# EAGLE schematic FE LED (EAGLE 9.6.2)
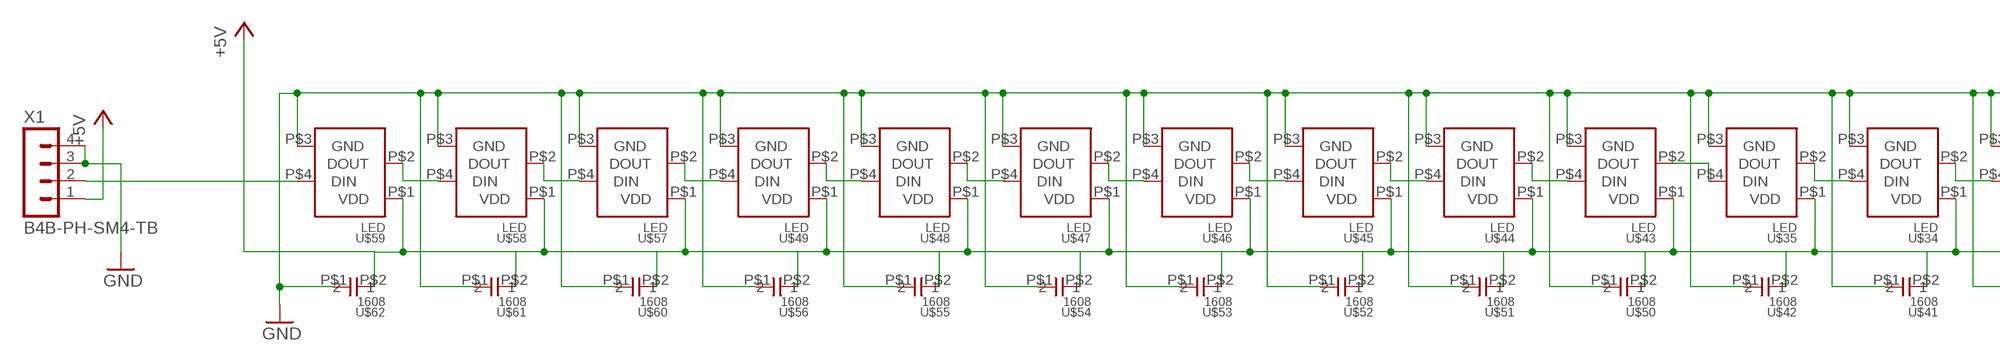
[diagram p0: schematic, sheet 1, part 1 of 2]
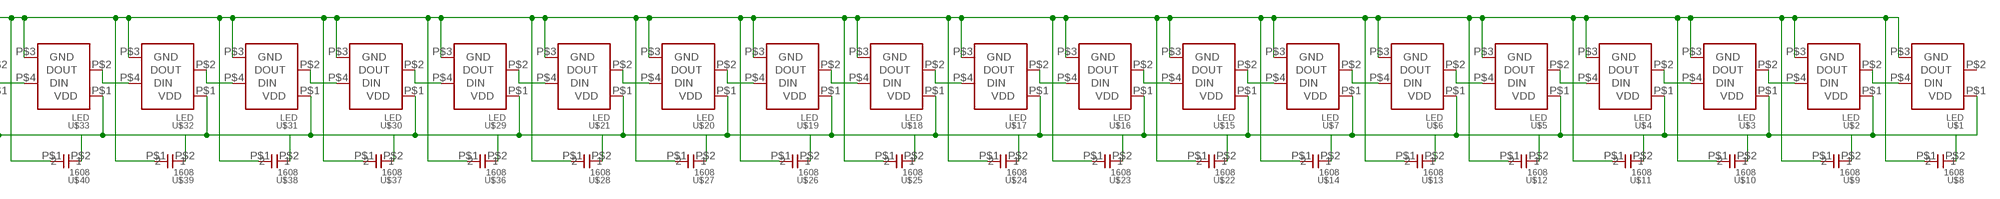
[diagram p1: schematic, sheet 1, part 2 of 2]

## Parts
U$1  LED  [LED]
U$2  LED  [LED]
U$3  LED  [LED]
U$4  LED  [LED]
U$5  LED  [LED]
U$6  LED  [LED]
U$7  LED  [LED]
U$8  1608  [CON]
U$9  1608  [CON]
U$10  1608  [CON]
U$11  1608  [CON]
U$12  1608  [CON]
U$13  1608  [CON]
U$14  1608  [CON]
U$15  LED  [LED]
U$16  LED  [LED]
U$17  LED  [LED]
U$18  LED  [LED]
U$19  LED  [LED]
U$20  LED  [LED]
U$21  LED  [LED]
U$22  1608  [CON]
U$23  1608  [CON]
U$24  1608  [CON]
U$25  1608  [CON]
U$26  1608  [CON]
U$27  1608  [CON]
U$28  1608  [CON]
U$29  LED  [LED]
U$30  LED  [LED]
U$31  LED  [LED]
U$32  LED  [LED]
U$33  LED  [LED]
U$34  LED  [LED]
U$35  LED  [LED]
U$36  1608  [CON]
U$37  1608  [CON]
U$38  1608  [CON]
U$39  1608  [CON]
U$40  1608  [CON]
U$41  1608  [CON]
U$42  1608  [CON]
U$43  LED  [LED]
U$44  LED  [LED]
U$45  LED  [LED]
U$46  LED  [LED]
U$47  LED  [LED]
U$48  LED  [LED]
U$49  LED  [LED]
U$50  1608  [CON]
U$51  1608  [CON]
U$52  1608  [CON]
U$53  1608  [CON]
U$54  1608  [CON]
U$55  1608  [CON]
U$56  1608  [CON]
U$57  LED  [LED]
U$58  LED  [LED]
U$59  LED  [LED]
U$60  1608  [CON]
U$61  1608  [CON]
U$62  1608  [CON]
X1  B4B-PH-SM4-TB  [B4B-PH-SM4-TB]

## Nets
+5V: U$1.P$1(VDD) U$2.P$1(VDD) U$3.P$1(VDD) U$4.P$1(VDD) U$5.P$1(VDD) U$6.P$1(VDD) U$7.P$1(VDD) U$8.P$2 U$9.P$2 U$10.P$2 U$11.P$2 U$12.P$2 U$13.P$2 U$14.P$2 U$15.P$1(VDD) U$16.P$1(VDD) U$17.P$1(VDD) U$18.P$1(VDD) U$19.P$1(VDD) U$20.P$1(VDD) U$21.P$1(VDD) U$22.P$2 U$23.P$2 U$24.P$2 U$25.P$2 U$26.P$2 U$27.P$2 U$28.P$2 U$29.P$1(VDD) U$30.P$1(VDD) U$31.P$1(VDD) U$32.P$1(VDD) U$33.P$1(VDD) U$34.P$1(VDD) U$35.P$1(VDD) U$36.P$2 U$37.P$2 U$38.P$2 U$39.P$2 U$40.P$2 U$41.P$2 U$42.P$2 U$43.P$1(VDD) U$44.P$1(VDD) U$45.P$1(VDD) U$46.P$1(VDD) U$47.P$1(VDD) U$48.P$1(VDD) U$49.P$1(VDD) U$50.P$2 U$51.P$2 U$52.P$2 U$53.P$2 U$54.P$2 U$55.P$2 U$56.P$2 U$57.P$1(VDD) U$58.P$1(VDD) U$59.P$1(VDD) U$60.P$2 U$61.P$2 U$62.P$2 X1.1
GND: U$1.P$3(GND) U$2.P$3(GND) U$3.P$3(GND) U$4.P$3(GND) U$5.P$3(GND) U$6.P$3(GND) U$7.P$3(GND) U$8.P$1 U$9.P$1 U$10.P$1 U$11.P$1 U$12.P$1 U$13.P$1 U$14.P$1 U$15.P$3(GND) U$16.P$3(GND) U$17.P$3(GND) U$18.P$3(GND) U$19.P$3(GND) U$20.P$3(GND) U$21.P$3(GND) U$22.P$1 U$23.P$1 U$24.P$1 U$25.P$1 U$26.P$1 U$27.P$1 U$28.P$1 U$29.P$3(GND) U$30.P$3(GND) U$31.P$3(GND) U$32.P$3(GND) U$33.P$3(GND) U$34.P$3(GND) U$35.P$3(GND) U$36.P$1 U$37.P$1 U$38.P$1 U$39.P$1 U$40.P$1 U$41.P$1 U$42.P$1 U$43.P$3(GND) U$44.P$3(GND) U$45.P$3(GND) U$46.P$3(GND) U$47.P$3(GND) U$48.P$3(GND) U$49.P$3(GND) U$50.P$1 U$51.P$1 U$52.P$1 U$53.P$1 U$54.P$1 U$55.P$1 U$56.P$1 U$57.P$3(GND) U$58.P$3(GND) U$59.P$3(GND) U$60.P$1 U$61.P$1 U$62.P$1 X1.3 X1.4
N$3: U$59.P$4(DIN) X1.2
N$4: U$1.P$4(DIN) U$2.P$2(DOUT)
N$5: U$2.P$4(DIN) U$3.P$2(DOUT)
N$6: U$3.P$4(DIN) U$4.P$2(DOUT)
N$7: U$4.P$4(DIN) U$5.P$2(DOUT)
N$8: U$5.P$4(DIN) U$6.P$2(DOUT)
N$9: U$6.P$4(DIN) U$7.P$2(DOUT)
N$12: U$15.P$4(DIN) U$16.P$2(DOUT)
N$13: U$16.P$4(DIN) U$17.P$2(DOUT)
N$14: U$17.P$4(DIN) U$18.P$2(DOUT)
N$15: U$18.P$4(DIN) U$19.P$2(DOUT)
N$16: U$19.P$4(DIN) U$20.P$2(DOUT)
N$17: U$20.P$4(DIN) U$21.P$2(DOUT)
N$19: U$21.P$4(DIN) U$29.P$2(DOUT)
N$20: U$29.P$4(DIN) U$30.P$2(DOUT)
N$21: U$30.P$4(DIN) U$31.P$2(DOUT)
N$22: U$31.P$4(DIN) U$32.P$2(DOUT)
N$23: U$32.P$4(DIN) U$33.P$2(DOUT)
N$24: U$33.P$4(DIN) U$34.P$2(DOUT)
N$25: U$34.P$4(DIN) U$35.P$2(DOUT)
N$28: U$43.P$4(DIN) U$44.P$2(DOUT)
N$29: U$44.P$4(DIN) U$45.P$2(DOUT)
N$30: U$45.P$4(DIN) U$46.P$2(DOUT)
N$31: U$46.P$4(DIN) U$47.P$2(DOUT)
N$32: U$47.P$4(DIN) U$48.P$2(DOUT)
N$33: U$48.P$4(DIN) U$49.P$2(DOUT)
N$34: U$7.P$4(DIN) U$15.P$2(DOUT)
N$35: U$49.P$4(DIN) U$57.P$2(DOUT)
N$36: U$57.P$4(DIN) U$58.P$2(DOUT)
N$37: U$58.P$4(DIN) U$59.P$2(DOUT)
N$40: U$35.P$4(DIN) U$43.P$2(DOUT)
Unconnected: U$1.P$2(DOUT)

## Library data of the parts
U$1-U$7 U$15-U$21 U$29-U$35 U$43-U$49 U$57-U$59 = フルカラーLED:LED
U$8-U$14 U$22-U$28 U$36-U$42 U$50-U$56 U$60-U$62 = con1608:1608
X1 = con-JST PH:B4B-PH: JST PH series header 2.00mm pitch disconnectable crimp style connectors, vertical (side entry type), 4 pins